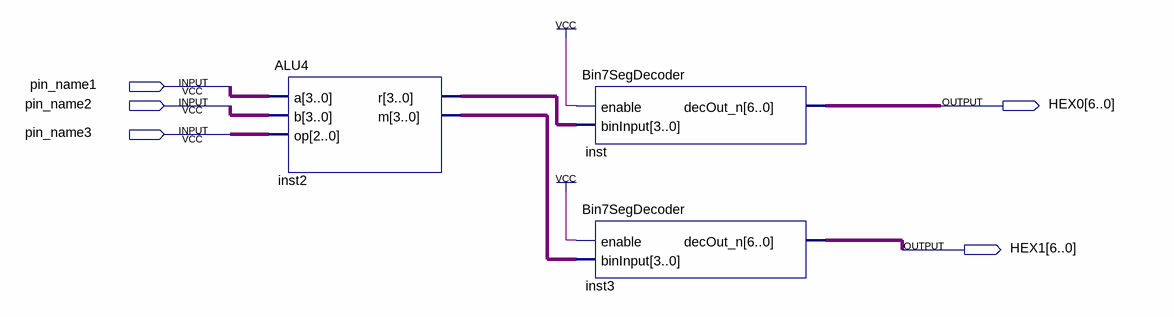
[diagram p0: schematic sheet]
// Quartus schematic ALUDemo.bdf as structural Verilog: 3 symbols, 5 pins
module ALUDemo (
  input  pin_name1,
  input  pin_name2,
  input  pin_name3,
  output [6:0] HEX0,
  output [6:0] HEX1
);

  wire [2:0] undriven_2;
  wire [3:0] inst2_m, inst2_r, undriven, undriven_3;

  ALU4 inst2 (.a(undriven_3), .b(undriven), .op(undriven_2), .r(inst2_r), .m(inst2_m));
  Bin7SegDecoder inst (.enable(1'b1), .binInput(inst2_r), .decOut_n(HEX0));
  Bin7SegDecoder inst3 (.enable(1'b1), .binInput(inst2_m), .decOut_n(HEX1));
endmodule
